# Altium schematic sheet Keyboard-Right.SchDoc: Insane Keyboard
size A4; Author: Parth Thakkar; CompanyName: Insane; DrawnBy: Parth; Engineer: Parth; Organization: Low Self Esteam; DocumentNumber: 1; Revision: v1.0; SheetNumber: 1; SheetTotal: 8
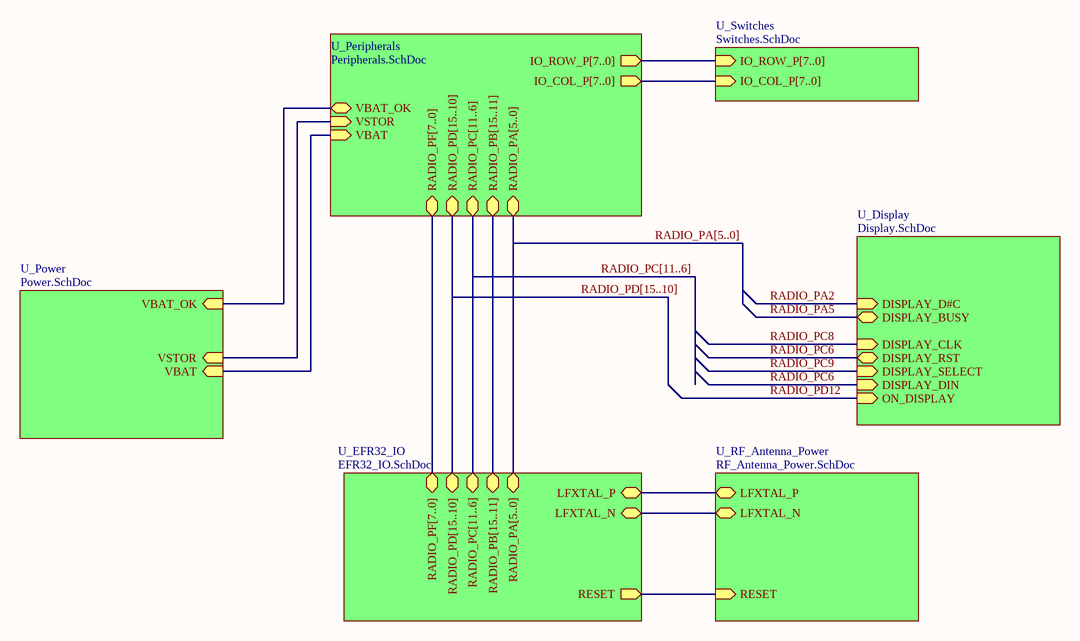
[diagram p0: Keyboard-Right.SchDoc]

## Sub-sheets
U_Display = Display.SchDoc: DISPLAY_DIN (in), DISPLAY_CLK (in), DISPLAY_D#C (in), DISPLAY_SELECT (in), DISPLAY_RST (bidir), DISPLAY_BUSY (bidir), ON_DISPLAY (in)
U_EFR32_IO = EFR32_IO.SchDoc: RADIO_PA[5..0] (bidir), RADIO_PD[15..10] (bidir), RADIO_PF[7..0] (bidir), RADIO_PB[15..11] (bidir), RADIO_PC[11..6] (bidir), RESET (out), LFXTAL_N (bidir), LFXTAL_P (bidir)
U_Peripherals = Peripherals.SchDoc: IO_ROW_P[7..0] (out), IO_COL_P[7..0] (out), VBAT_OK (bidir), VSTOR (in), VBAT (in), RADIO_PA[5..0] (bidir), RADIO_PC[11..6] (bidir), RADIO_PD[15..10] (bidir), RADIO_PB[15..11] (bidir), RADIO_PF[7..0] (bidir)
U_Power = Power.SchDoc: VBAT_OK (in), VSTOR (in), VBAT (in)
U_RF_Antenna_Power = RF_Antenna_Power.SchDoc: RESET (in), LFXTAL_N (bidir), LFXTAL_P (bidir)
U_Switches = Switches.SchDoc: IO_ROW_P[7..0] (in), IO_COL_P[7..0] (in)

## Nets
RADIO_PA2: sheet U_Display/DISPLAY_D#C
RADIO_PA5: sheet U_Display/DISPLAY_BUSY
RADIO_PC6: sheet U_Display/DISPLAY_DIN, sheet U_Display/DISPLAY_RST
RADIO_PC8: sheet U_Display/DISPLAY_CLK
RADIO_PC9: sheet U_Display/DISPLAY_SELECT
RADIO_PD12: sheet U_Display/ON_DISPLAY
(unnamed): sheet U_Power/VBAT_OK, sheet U_Peripherals/VBAT_OK
(unnamed): sheet U_Power/VSTOR, sheet U_Peripherals/VSTOR
(unnamed): sheet U_Power/VBAT, sheet U_Peripherals/VBAT
(unnamed): sheet U_RF_Antenna_Power/RESET, sheet U_EFR32_IO/RESET
(unnamed): sheet U_RF_Antenna_Power/LFXTAL_N, sheet U_EFR32_IO/LFXTAL_N
(unnamed): sheet U_RF_Antenna_Power/LFXTAL_P, sheet U_EFR32_IO/LFXTAL_P

## Buses and harness runs
bus RADIO_PA[5..0] = sheet U_EFR32_IO/RADIO_PA[5..0] = sheet U_Peripherals/RADIO_PA[5..0]
bus RADIO_PC[11..6] = sheet U_EFR32_IO/RADIO_PC[11..6] = sheet U_Peripherals/RADIO_PC[11..6]
bus RADIO_PD[15..10] = sheet U_EFR32_IO/RADIO_PD[15..10] = sheet U_Peripherals/RADIO_PD[15..10]
bus sheet U_EFR32_IO/RADIO_PB[15..11] = sheet U_Peripherals/RADIO_PB[15..11]
bus sheet U_EFR32_IO/RADIO_PF[7..0] = sheet U_Peripherals/RADIO_PF[7..0]
bus sheet U_Peripherals/IO_COL_P[7..0] = sheet U_Switches/IO_COL_P[7..0]
bus sheet U_Peripherals/IO_ROW_P[7..0] = sheet U_Switches/IO_ROW_P[7..0]